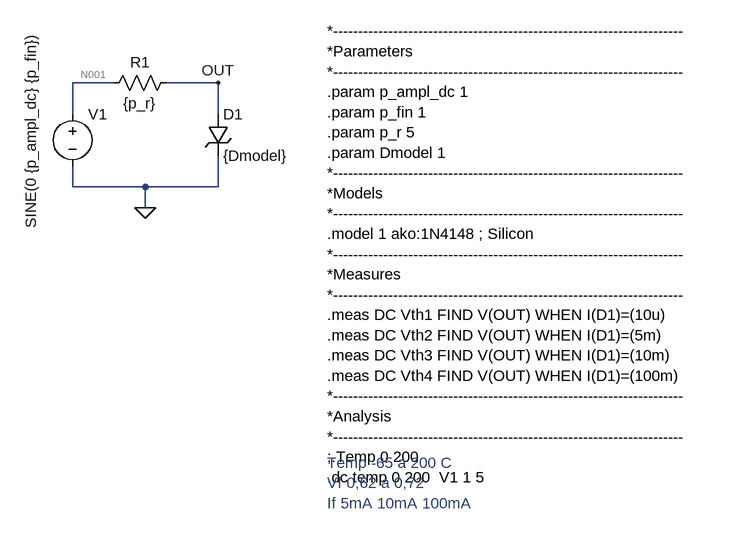
[diagram p0: schematic DIODE_1N4148 _TEMP.asc]
DIODE_1N4148 _TEMP.asc, the LTspice schematic file:
Version 4
SHEET 1 1236 688
WIRE 176 32 112 32
WIRE 336 32 256 32
WIRE 112 80 112 32
WIRE 336 80 336 32
WIRE 112 192 112 160
WIRE 224 192 112 192
WIRE 336 192 336 144
WIRE 336 192 224 192
WIRE 224 224 224 192
FLAG 224 224 0
FLAG 336 32 OUT
SYMBOL voltage 112 64 R0
WINDOW 3 -64 -111 VRight 2
WINDOW 123 0 0 Left 0
WINDOW 39 0 0 Left 0
SYMATTR Value SINE(0 {p_ampl_dc} {p_fin})
SYMATTR InstName V1
SYMBOL res 272 16 R90
WINDOW 0 0 56 VBottom 2
WINDOW 3 32 56 VTop 2
SYMATTR InstName R1
SYMATTR Value {p_r}
SYMBOL zener 320 80 R0
SYMATTR InstName D1
SYMATTR Value {Dmodel}
SYMATTR Description Diode
SYMATTR Type diode
TEXT 504 -48 Left 2 !*----------------------------------------------------------------------\n*Parameters\n*----------------------------------------------------------------------\n.param p_ampl_dc 1\n.param p_fin 1\n.param p_r 5\n.param Dmodel 1\n*----------------------------------------------------------------------\n*Models\n*----------------------------------------------------------------------\n.model 1 ako:1N4148 ; Silicon\n*----------------------------------------------------------------------\n*Measures\n*----------------------------------------------------------------------\n.meas DC Vth1 FIND V(OUT) WHEN I(D1)=(10u)\n.meas DC Vth2 FIND V(OUT) WHEN I(D1)=(5m)\n.meas DC Vth3 FIND V(OUT) WHEN I(D1)=(10m)\n.meas DC Vth4 FIND V(OUT) WHEN I(D1)=(100m)\n*----------------------------------------------------------------------\n*Analysis\n*----------------------------------------------------------------------\n;.Temp 0 200\n.dc temp 0 200  V1 1 5
TEXT 504 616 Left 2 ;Temp -65 a 200 C\nVf 0,62 a 0,72\nIf 5mA 10mA 100mA

The netlist it stands for:
* DIODE_1N4148 _TEMP.asc
V1 N001 0 SINE(0 {p_ampl_dc} {p_fin})
R1 OUT N001 {p_r}
D1 OUT 0 {Dmodel}
.model D D
.lib standard.dio
*----------------------------------------------------------------------
*Parameters
*----------------------------------------------------------------------
.param p_ampl_dc 1
.param p_fin 1
.param p_r 5
.param Dmodel 1
*----------------------------------------------------------------------
*Models
*----------------------------------------------------------------------
.model 1 ako:1N4148 ; Silicon
*----------------------------------------------------------------------
*Measures
*----------------------------------------------------------------------
.meas DC Vth1 FIND V(OUT) WHEN I(D1)=(10u)
.meas DC Vth2 FIND V(OUT) WHEN I(D1)=(5m)
.meas DC Vth3 FIND V(OUT) WHEN I(D1)=(10m)
.meas DC Vth4 FIND V(OUT) WHEN I(D1)=(100m)
*----------------------------------------------------------------------
*Analysis
*----------------------------------------------------------------------
;.Temp 0 200
.dc temp 0 200  V1 1 5
* Temp -65 a 200 C
* Vf 0,62 a 0,72
* If 5mA 10mA 100mA
.backanno
.end

* Results of the author's LTspice run, read from the files saved beside the schematic
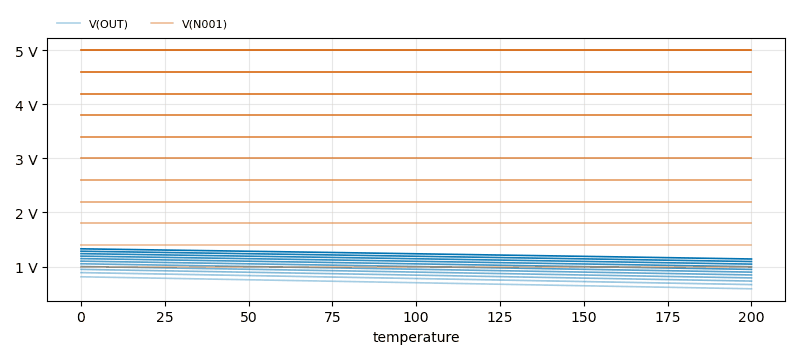
[diagram p1: DC transfer characteristic of DIODE_1N4148 _TEMP.asc, plotted from the saved traces]
* DC transfer characteristic, 11 runs:
*   V(OUT) [v1=1]: 809.8 mV at temperature=0, 587.5 mV at temperature=200 , min 587.5 mV, max 809.8 mV
*   V(OUT) [v1=1.4]: 887.3 mV at temperature=0, 665.4 mV at temperature=200 , min 665.4 mV, max 887.3 mV
*   V(OUT) [v1=1.8]: 947 mV at temperature=0, 730.3 mV at temperature=200 , min 730.3 mV, max 947 mV
*   V(OUT) [v1=2.2]: 1 V at temperature=0, 788.8 mV at temperature=200 , min 788.8 mV, max 1 V
*   V(OUT) [v1=2.6]: 1.051 V at temperature=0, 843.7 mV at temperature=200 , min 843.7 mV, max 1.051 V
*   V(OUT) [v1=3]: 1.099 V at temperature=0, 896.1 mV at temperature=200 , min 896.1 mV, max 1.099 V
*   V(OUT) [v1=3.4]: 1.146 V at temperature=0, 946.7 mV at temperature=200 , min 946.7 mV, max 1.146 V
*   V(OUT) [v1=3.8]: 1.192 V at temperature=0, 996.1 mV at temperature=200 , min 996.1 mV, max 1.192 V
*   V(N001) [v1=1]: 1 V at temperature=0, 1 V at temperature=200 , min 1 V, max 1 V
*   V(N001) [v1=1.4]: 1.4 V at temperature=0, 1.4 V at temperature=200 , min 1.4 V, max 1.4 V
*   V(N001) [v1=1.8]: 1.8 V at temperature=0, 1.8 V at temperature=200 , min 1.8 V, max 1.8 V
*   V(N001) [v1=2.2]: 2.2 V at temperature=0, 2.2 V at temperature=200 , min 2.2 V, max 2.2 V
*   V(N001) [v1=2.6]: 2.6 V at temperature=0, 2.6 V at temperature=200 , min 2.6 V, max 2.6 V
*   V(N001) [v1=3]: 3 V at temperature=0, 3 V at temperature=200 , min 3 V, max 3 V
*   V(N001) [v1=3.4]: 3.4 V at temperature=0, 3.4 V at temperature=200 , min 3.4 V, max 3.4 V
*   V(N001) [v1=3.8]: 3.8 V at temperature=0, 3.8 V at temperature=200 , min 3.8 V, max 3.8 V
* From the log:
*   Measurement "vth1" FAIL'ed
*   Measurement "vth2" FAIL'ed
*   Measurement "vth3" FAIL'ed
*   Measurement: vth4
*     step  v(out)  at
*        1  0  0
*        2  0.887309  0.00669092
*        3  0.946975  4.97442e-06
*        4  1.00041  7.41515e-08
*        5  1.05068  3.78582e-09
*        6  1.09906  3.79218e-10
*        7  1.14617  5.81312e-11
*        8  1.19238  1.19452e-11
*        9  1.2379  3.0405e-12
*       10  1.2829  9.11119e-13
*       11  1.32747  3.1047e-13